# Altium schematic sheet Power.SchDoc
size 420 x 297 mm; SheetNumber: 2; SheetTotal: 6; SPICEModelCacheKNAGYUHY: <root> / <DocumentId>KNAGYUHY</DocumentId> / </root>
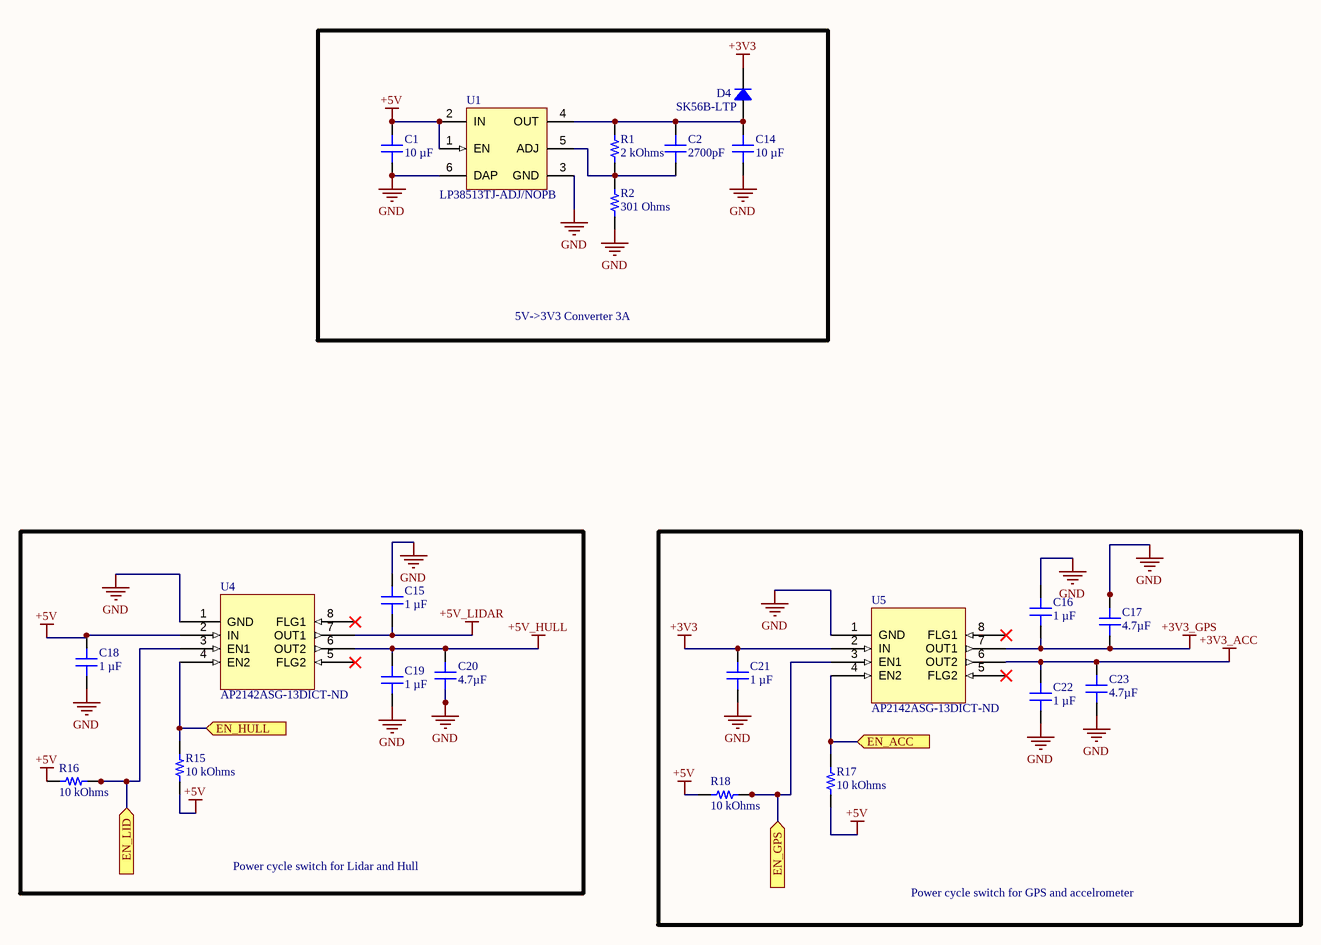
[diagram p0: Power.SchDoc]

## Parts
C1  10 µF  [CAP 0805_2012]
C2  2700pF  [CAP 0603_1608]
C14  10 µF  [CAP 0805_2012]
C15  1 µF  [CAP 0603_1608]
C16  1 µF  [CAP 0603_1608]
C17  4.7µF  [CAP 0805_2012]
C18  1 µF  [CAP 0603_1608]
C19  1 µF  [CAP 0603_1608]
C20  4.7µF  [CAP 0805_2012]
C21  1 µF  [CAP 0603_1608]
C22  1 µF  [CAP 0603_1608]
C23  4.7µF  [CAP 0805_2012]
D4  SK56B-LTP  [DO214AA SMB]
R1  2 kOhms  [RES 0603_1608]
R2  301 Ohms  [RES 0603_1608]
R15  10 kOhms  [RES 0603_1608]
R16  10 kOhms  [RES 0603_1608]
R17  10 kOhms  [RES 0603_1608]
R18  10 kOhms  [RES 0603_1608]
U1  LP38513TJ-ADJ/NOPB  [NDQ0005A_M]
U4  AP2142ASG-13DICT-ND  [SOP127P600X175-8N]
U5  AP2142ASG-13DICT-ND  [SOP127P600X175-8N]

## Blocks framed on the sheet
5V->3V3 Converter 3A: C1 C2 C14 D4 R1 R2 U1
Power cycle switch for Lidar and Hull: C15 C18-C20 R15 R16 U4
Power cycle switch for GPS and accelrometer: C16 C17 C21-C23 R17 R18 U5

## Ports
EN_ACC (in), EN_GPS (in), EN_HULL (in), EN_LID (in)

## Nets
+3V3: C21.1 D4.2 U5.2(IN)
+3V3_ACC: C22.2 C23.2 U5.6(OUT2)
+3V3_GPS: C16.1 C17.2 U5.7(OUT1)
+5V: C1.2 C18.1 R15.2 R16.2 R17.2 R18.2 U1.1(EN) U1.2(IN) U4.2(IN)
+5V_HULL: C19.2 C20.2 U4.6(OUT2)
+5V_LIDAR: C15.1 U4.7(OUT1)
GND: C1.1 C14.1 C15.2 C16.2 C17.1 C18.2 C19.1 C20.1 C21.2 C22.1 C23.1 R2.1 U1.3(GND) U1.6(DAP) U4.1(GND) U5.1(GND)
EN_ACC: R17.1 U5.4(EN2) ; port EN_ACC
EN_GPS: R18.1 U5.3(EN1) ; port EN_GPS
EN_HULL: R15.1 U4.4(EN2) ; port EN_HULL
EN_LID: R16.1 U4.3(EN1) ; port EN_LID
NetC2_1: C2.1 R1.1 R2.2 U1.5(ADJ)
NetC2_2: C2.2 C14.2 D4.1 R1.2 U1.4(OUT)

Not connected (* = marked no-connect by the designer): U4 5(FLG2)* 8(FLG1)*; U5 5(FLG2)* 8(FLG1)*

## Notes on the sheet
- THIS DOCUMENT AND THE DATA DISCLOSED HEREIN OR
- HEREWITH IS THE PROPERTY OF ALTIUM LIMITED AND MAY
- DWG NO:
- REVISION
- REV:
- DESCRIPTION
- DATE
- APPROVED
- BE FREELY DISTRIBUTED IN WHOLE. NO RIGHTS ARE
- RESERVED OR EXPRESS OR IMPLIED WARANTEE GIVEN.
- ENG:
- APPROVALS
- PROJECT
- DSN:
- CHK:
- REFERENCE DOCUMENTS
- PROJECT REVISION:
- TITLE
- DOCUMENT REVISION:
- DESIGN ITEM:
- BOM:
- FAB DWG:
- PCB DWG:
- ASSY DWG:
- SCALE:
- A3
- SIZE
- CAGE CODE
- FILE NAME
- DWG NO.
- SHEET
- OF
- REV

## Library data of the parts
C1 C14 = CGA4J1X5R1C106K125AC: CAP CER 10UF 16V X5R 0805; manufacturer: TDK Corporation; Tolerance: ±10%; Part Number: CGA4J1X5R1C106K125AC; Value: 10 µF; Applications: Automotive; Capacitance: 10 µF; componentlink1description: Datasheet; componentlink1url: https://product.tdk.com/info/en/catalog/datasheets/mlcc_automotive_general_en.pdf?ref_disty=digikey; componentlink2description: DigiKey Link; componentlink2url: https://www.digikey.com/en/products/detail/tdk-corporation/CGA4J1X5R1C106K125AC/2781309; Device Package: 0805 (2012 Metric); lastupdated: 2022-04-02 5:58:40 AM; Lifecycle Status: Active; Minimum Order: 1; Mounting Type: Surface Mount, MLCC; Operating Temperature: -55°C ~ 85°C; Package / Case: 0805 (2012 Metric); packaging: TapeAndReel; partid: 3076; Part Status: Active; price: 0.09; Ratings: AEC-Q200; series: CGA; Size / Dimension: 0.079" L x 0.049" W (2.00mm x 1.25mm); Supplier 1: DigiKey; Supplier Part Number 1: 445-7883-1-ND; Temperature Coefficient: X5R; Thickness (Max): 0.057" (1.45mm); Voltage - Rated: 16V
C2 = 06035C272KAT2A: CAP CER 2700PF 50V X7R 0603; manufacturer: AVX Corporation; Tolerance: ±10%; Part Number: 06035C272KAT2A; Value: 2700pF; Applications: General Purpose; Capacitance: 2700pF; componentlink1description: Datasheet; componentlink1url: http://datasheets.avx.com/X7RDielectric.pdf; componentlink2description: DigiKey Link; componentlink2url: http://digikey.com/product-detail/en/avx-corporation/06035C272KAT2A/478-1220-1-ND/564252; Device Package: 0603 (1608 Metric); lastupdated: 2020-09-02 1:03:32 AM; Lifecycle Status: Active; Minimum Order: 1; Mounting Type: Surface Mount, MLCC; Operating Temperature: -55°C ~ 125°C; Package / Case: 0603 (1608 Metric); packaging: TapeAndReel; partid: 4337; Part Status: Active; price: 0.02; series: -; Size / Dimension: 0.063" L x 0.032" W (1.60mm x 0.81mm); Supplier 1: DigiKey; Supplier Part Number 1: 478-1220-1-ND; Temperature Coefficient: X7R; Thickness (Max): 0.035" (0.90mm); Voltage - Rated: 50V
C15 C16 C18 C19 C21 C22 = CM105X7R105K16ATH: CAP CER 1UF 16V X7R 0603; manufacturer: KYOCERA AVX; Tolerance: ±10%; Part Number: CM105X7R105K16ATH; Value: 1 µF; Applications: General Purpose; Capacitance: 1 µF; componentlink1description: Datasheet; componentlink1url: https://ele.kyocera.com/assets/products/capacitor/CM_Series_e.pdf; componentlink2description: DigiKey Link; componentlink2url: https://www.digikey.com/en/products/detail/kyocera-avx/CM105X7R105K16ATH/10197120; Device Package: 0603 (1608 Metric); lastupdated: 2022-03-07 3:17:15 PM; Lifecycle Status: Active; Minimum Order: 1; Mounting Type: Surface Mount, MLCC; Operating Temperature: -55°C ~ 125°C; Package / Case: 0603 (1608 Metric); packaging: TapeAndReel; partid: 34778; Part Status: Active; price: 0.03; series: CM; Size / Dimension: 0.063" L x 0.031" W (1.60mm x 0.80mm); Supplier 1: DigiKey; Supplier Part Number 1: 478-CM105X7R105K16ATHCT-ND; Temperature Coefficient: X7R; Thickness (Max): 0.035" (0.90mm); Voltage - Rated: 16V
C17 C20 C23 = 0805ZC475MAT2A: CAP CER 4.7UF 10V X7R 0805; manufacturer: AVX Corporation; Tolerance: ±20%; Part Number: 0805ZC475MAT2A; Value: 4.7µF; Applications: General Purpose; Capacitance: 4.7µF; componentlink1description: Datasheet; componentlink1url: http://datasheets.avx.com/X7RDielectric.pdf; componentlink2description: DigiKey Link; componentlink2url: http://digikey.com/product-detail/en/avx-corporation/0805ZC475MAT2A/478-7965-1-ND/3881588; Device Package: 0805 (2012 Metric); lastupdated: 2020-09-02 1:04:25 AM; Lifecycle Status: Active; Minimum Order: 1; Mounting Type: Surface Mount, MLCC; Operating Temperature: -55°C ~ 125°C; Package / Case: 0805 (2012 Metric); packaging: TapeAndReel; partid: 11941; Part Status: Active; price: 0.29; series: -; Size / Dimension: 0.079" L x 0.049" W (2.00mm x 1.25mm); Supplier 1: DigiKey; Supplier Part Number 1: 478-7965-1-ND; Temperature Coefficient: X7R; Thickness (Max): 0.060" (1.52mm); Voltage - Rated: 10V
D4 = SK56B-LTP: DIODE SCHOTTKY 60V 5A DO214AA; Manufacturer: Micro Commercial Co; Capacitance @ Vr, F: 200pF @ 4V, 1MHz; Current - Reverse Leakage @ Vr: 1 mA @ 60 V; Speed: Fast Recovery =< 500ns, > 200mA (Io); Voltage - Forward (Vf) (Max) @ If: 750 mV @ 5 A; Part Number: SK56B-LTP; ComponentLink1Description: Datasheet; ComponentLink1URL: https://www.mccsemi.com/pdf/Products/SK52B-L-SK520B-L(DO-214AA).pdf; ComponentLink2Description: DigiKey Link; ComponentLink2URL: https://www.digikey.com/en/products/detail/micro-commercial-co/SK56B-LTP/5865060; Current - Average Rectified (Io): 5A; Diode Type: Schottky; LastUpdated: 2022-03-07 3:54:27 PM; Lifecycle Status: Active; Minimum Order: 1; Mounting Type: Surface Mount; Operating Temperature - Junction: -55°C ~ 150°C; Package / Case: DO-214AA, SMB; Packaging: TapeAndReel; PartId: 1476; Part Status: Active; Price: 0.12; Series: -; Supplier 1: DigiKey; Supplier Part Number 1: SK56B-LTPMSCT-ND; Supplier Device Package: DO-214AA (SMB); Voltage - DC Reverse (Vr) (Max): 60 V
R1 = RMCF0603FT2K00: RES 2K OHM 1% 1/10W 0603; Manufacturer: Stackpole Electronics Inc; Power (Watts): 0.1W, 1/10W; Temperature Coefficient: ±100ppm/°C; Part Number: RMCF0603FT2K00; Value: 2 kOhms; ComponentLink1Description: Datasheet; ComponentLink1URL: https://www.seielect.com/catalog/sei-rmcf_rmcp.pdf; ComponentLink2Description: DigiKey Link; ComponentLink2URL: https://www.digikey.com/en/products/detail/stackpole-electronics-inc/RMCF0603FT2K00/1761334; Composition: Thick Film; Device Package: 0603 (1608 Metric); Features: Automotive AEC-Q200; Height - Seated (Max): 0.022" (0.55mm); LastUpdated: 2022-04-02 6:14:17 AM; Lifecycle Status: Active; Minimum Order: 1; Number of Terminations: 2; Operating Temperature: -55°C ~ 155°C; Package / Case: 0603 (1608 Metric); Packaging: CutTape; PartId: 6085; Part Status: Active; Price: 0.01; Ratings: AEC-Q200; Resistance: 2 kOhms; Series: RMCF; Size / Dimension: 0.061" L x 0.031" W (1.55mm x 0.80mm); Supplier 1: DigiKey; Supplier Part Number 1: RMCF0603FT2K00CT-ND; Supplier Device Package: 0603; Tolerance: ±1%
R2 = RMCF0603FT301R: RES 301 OHM 1% 1/10W 0603; Manufacturer: Stackpole Electronics Inc; Power (Watts): 0.1W, 1/10W; Temperature Coefficient: ±100ppm/°C; Part Number: RMCF0603FT301R; Value: 301 Ohms; ComponentLink1Description: Datasheet; ComponentLink1URL: https://www.seielect.com/catalog/sei-rmcf_rmcp.pdf; ComponentLink2Description: DigiKey Link; ComponentLink2URL: https://www.digikey.com/en/products/detail/stackpole-electronics-inc/RMCF0603FT301R/1760800; Composition: Thick Film; Device Package: 0603 (1608 Metric); Features: Automotive AEC-Q200; Height - Seated (Max): 0.022" (0.55mm); LastUpdated: 2022-09-19 1:22:12 PM; Lifecycle Status: Active; Minimum Order: 1; Number of Terminations: 2; Operating Temperature: -55°C ~ 155°C; Package / Case: 0603 (1608 Metric); Packaging: CutTape; PartId: 10665; Part Status: Active; Price: 0.01; Ratings: AEC-Q200; Resistance: 301 Ohms; Series: RMCF; Size / Dimension: 0.061" L x 0.031" W (1.55mm x 0.80mm); Supplier 1: DigiKey; Supplier Part Number 1: RMCF0603FT301RCT-ND; Supplier Device Package: 0603; Tolerance: ±1%
R15-R18 = RT0603FRE0710KL: RES SMD 10K OHM 1% 1/10W 0603; Manufacturer: Yageo; Power (Watts): 0.1W, 1/10W; Temperature Coefficient: ±50ppm/°C; Part Number: RT0603FRE0710KL; Value: 10 kOhms; ComponentLink1Description: Datasheet; ComponentLink1URL: https://www.yageo.com/upload/media/product/productsearch/datasheet/rchip/PYu-RT_1-to-0.01_RoHS_L_11.pdf; ComponentLink2Description: DigiKey Link; ComponentLink2URL: http://digikey.com/product-detail/en/yageo/RT0603FRE0710KL/YAG2321CT-ND/5252435; Composition: Thin Film; Device Package: 0603 (1608 Metric); Height - Seated (Max): 0.022" (0.55mm); LastUpdated: 2022-03-07 3:35:56 PM; Lifecycle Status: Active; Minimum Order: 1; Number of Terminations: 2; Operating Temperature: -55°C ~ 155°C; Package / Case: 0603 (1608 Metric); Packaging: TapeAndReel; PartId: 5671; Part Status: Active; Price: 0.01; Resistance: 10 kOhms; Series: RT; Size / Dimension: 0.063" L x 0.031" W (1.60mm x 0.80mm); Supplier 1: DigiKey; Supplier Part Number 1: YAG2321CT-ND; Supplier Device Package: 0603; Tolerance: ±1%
U1 = CMP-0062-00087-3: 3A Fast-Transient Response Adjustable Low-Dropout Linear Voltage Regulator, 5-pin TO-263 Thin, Pb-Free; Manufacturer: Texas Instruments; CompType: LDO IC; PowerWise: N; PackageTopMarking: NSUZXYTTE#*LP38513*TJ-ADJ; PackageDescription: Thin TO-263, Molded, 9.85 x 10.16 x 2mm Body, 5 Lead, 1.7mm Pitch, Surface Mount; ComponentLink1Description: Datasheet URL; PackageReference: NDQ0005A; ComponentLink1URL: http://www.ti.com/general/docs/lit/getliterature.tsp?genericPartNumber=LP38513-ADJ&fileType=pdf; PinCount: 5; RoHS: Y
U4 U5 = CMP-00033-7: AP2142A Series 5.5 V 0.5 A Dual Channel Current-Limited Power Switch - SOIC-8; Max Output Current: 500mA; Output Configuration: High Side; Number of Outputs: 2; Max Supply Voltage: 5.5V; On-State Resistance: 130mR; Min Supply Voltage: 2.7V; Interface: On/Off; Fault Protection: Over Temperature,Reverse Current; Weight: 0.00261oz; Min Operating Temperature: -40°C; RoHS Compliant: Yes; Series: -; Number of Pins: 8; Number of Switches: 2; Packaging: Tape and Reel; Max Operating Temperature: 85°C; Case/Package: SO; Package Quantity: 2500; Mount: Surface Mount; Radiation Hardening: No; REACH SVHC: No SVHC